# Altium schematic sheet BoardA-FPGA.SchDoc
size A; SheetNumber: 2; SheetTotal: 9
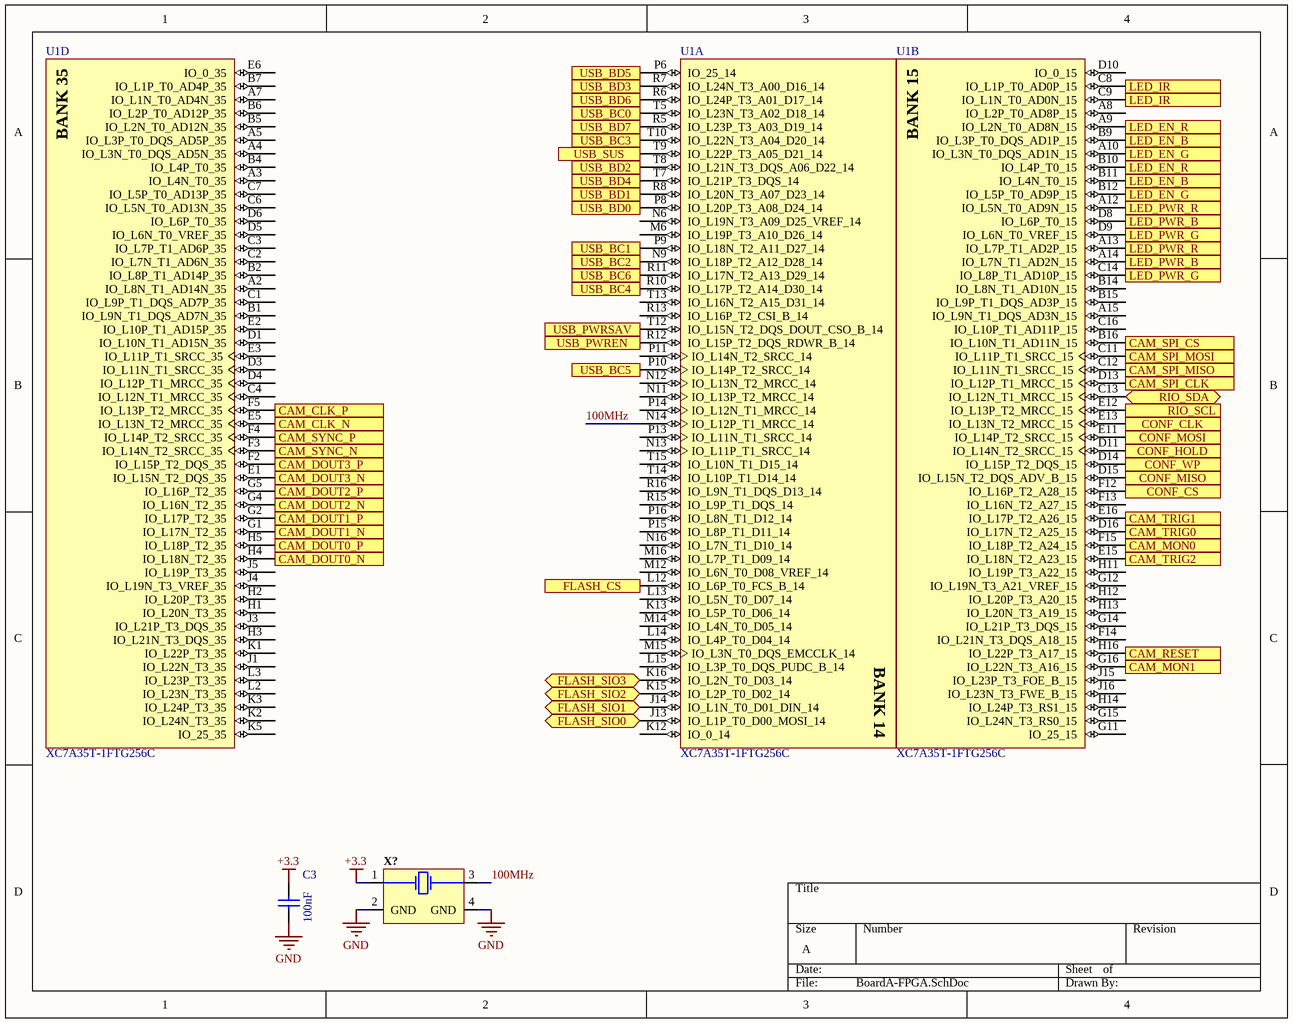
[diagram p0: BoardA-FPGA.SchDoc]

## Parts
C3  100nF  [CAPC0603X33X15ML03T05]
U1  XC7A35T-1FTG256C  [FTG256]  (parts A,B,D of 8)
X?  ASDMB-100.000MHZ-XY-T  [ASTMHTA-100.000MHZ-AJ-E-T]  (value not drawn)

## Ports
CAM_CLK_N (in), CAM_CLK_P (in), CAM_DOUT0_N (in), CAM_DOUT0_P (in), CAM_DOUT1_N (in), CAM_DOUT1_P (in), CAM_DOUT2_N (in), CAM_DOUT2_P (in), CAM_DOUT3_N (in), CAM_DOUT3_P (in), CAM_MON0 (in), CAM_MON1 (in), CAM_RESET (out), CAM_SPI_CLK (out), CAM_SPI_CS (out), CAM_SPI_MISO (in), CAM_SPI_MOSI (out), CAM_SYNC_N (in), CAM_SYNC_P (in), CAM_TRIG0 (out), CAM_TRIG1 (out), CAM_TRIG2 (out), CONF_CLK (in), CONF_CS (in), CONF_HOLD (in), CONF_MISO (out), CONF_MOSI (in), CONF_WP (in), FLASH_CS (out), FLASH_SIO0 (bidir), FLASH_SIO1 (bidir), FLASH_SIO2 (bidir), FLASH_SIO3 (bidir), LED_EN_B (out), LED_EN_G (out), LED_EN_R (out), LED_IR (out), LED_PWR_B (out), LED_PWR_G (out), LED_PWR_R (out), RIO_SCL (out), RIO_SDA (bidir), USB_BC0, USB_BC1, USB_BC2, USB_BC3, USB_BC4, USB_BC5, USB_BC6, USB_BD0, USB_BD1, USB_BD2, USB_BD3, USB_BD4, USB_BD5, USB_BD6, USB_BD7, USB_PWREN (out), USB_PWRSAV (out), USB_SUS (out)

## Nets
+3.3: C3.2 X?.1
GND: C3.1 X?.2(GND) X?.4(GND)
100MHz: U1.N14(IO_L12P_T1_MRCC_14) X?.3
CAM_CLK_N: U1.E5(IO_L13N_T2_MRCC_35) ; port CAM_CLK_N
CAM_CLK_P: U1.F5(IO_L13P_T2_MRCC_35) ; port CAM_CLK_P
CAM_DOUT0_N: U1.H4(IO_L18N_T2_35) ; port CAM_DOUT0_N
CAM_DOUT0_P: U1.H5(IO_L18P_T2_35) ; port CAM_DOUT0_P
CAM_DOUT1_N: U1.G1(IO_L17N_T2_35) ; port CAM_DOUT1_N
CAM_DOUT1_P: U1.G2(IO_L17P_T2_35) ; port CAM_DOUT1_P
CAM_DOUT2_N: U1.G4(IO_L16N_T2_35) ; port CAM_DOUT2_N
CAM_DOUT2_P: U1.G5(IO_L16P_T2_35) ; port CAM_DOUT2_P
CAM_DOUT3_N: U1.E1(IO_L15N_T2_DQS_35) ; port CAM_DOUT3_N
CAM_DOUT3_P: U1.F2(IO_L15P_T2_DQS_35) ; port CAM_DOUT3_P
CAM_MON0: U1.F15(IO_L18P_T2_A24_15) ; port CAM_MON0
CAM_MON1: U1.G16(IO_L22N_T3_A16_15) ; port CAM_MON1
CAM_RESET: U1.H16(IO_L22P_T3_A17_15) ; port CAM_RESET
CAM_SPI_CLK: U1.D13(IO_L12P_T1_MRCC_15) ; port CAM_SPI_CLK
CAM_SPI_CS: U1.B16(IO_L10N_T1_AD11N_15) ; port CAM_SPI_CS
CAM_SPI_MISO: U1.C12(IO_L11N_T1_SRCC_15) ; port CAM_SPI_MISO
CAM_SPI_MOSI: U1.C11(IO_L11P_T1_SRCC_15) ; port CAM_SPI_MOSI
CAM_SYNC_N: U1.F3(IO_L14N_T2_SRCC_35) ; port CAM_SYNC_N
CAM_SYNC_P: U1.F4(IO_L14P_T2_SRCC_35) ; port CAM_SYNC_P
CAM_TRIG0: U1.D16(IO_L17N_T2_A25_15) ; port CAM_TRIG0
CAM_TRIG1: U1.E16(IO_L17P_T2_A26_15) ; port CAM_TRIG1
CAM_TRIG2: U1.E15(IO_L18N_T2_A23_15) ; port CAM_TRIG2
CONF_CLK: U1.E13(IO_L13N_T2_MRCC_15) ; port CONF_CLK
CONF_CS: U1.F12(IO_L16P_T2_A28_15) ; port CONF_CS
CONF_HOLD: U1.D11(IO_L14N_T2_SRCC_15) ; port CONF_HOLD
CONF_MISO: U1.D15(IO_L15N_T2_DQS_ADV_B_15) ; port CONF_MISO
CONF_MOSI: U1.E11(IO_L14P_T2_SRCC_15) ; port CONF_MOSI
CONF_WP: U1.D14(IO_L15P_T2_DQS_15) ; port CONF_WP
FLASH_CS: U1.L12(IO_L6P_T0_FCS_B_14) ; port FLASH_CS
FLASH_SIO0: U1.J13(IO_L1P_T0_D00_MOSI_14) ; port FLASH_SIO0
FLASH_SIO1: U1.J14(IO_L1N_T0_D01_DIN_14) ; port FLASH_SIO1
FLASH_SIO2: U1.K15(IO_L2P_T0_D02_14) ; port FLASH_SIO2
FLASH_SIO3: U1.K16(IO_L2N_T0_D03_14) ; port FLASH_SIO3
LED_EN_B: U1.B9(IO_L3P_T0_DQS_AD1P_15) U1.B11(IO_L4N_T0_15) ; port LED_EN_B
LED_EN_G: U1.A10(IO_L3N_T0_DQS_AD1N_15) U1.B12(IO_L5P_T0_AD9P_15) ; port LED_EN_G
LED_EN_R: U1.A9(IO_L2N_T0_AD8N_15) U1.B10(IO_L4P_T0_15) ; port LED_EN_R
LED_IR: U1.C8(IO_L1P_T0_AD0P_15) U1.C9(IO_L1N_T0_AD0N_15) ; port LED_IR
LED_PWR_B: U1.A14(IO_L7N_T1_AD2N_15) U1.D8(IO_L6P_T0_15) ; port LED_PWR_B
LED_PWR_G: U1.C14(IO_L8P_T1_AD10P_15) U1.D9(IO_L6N_T0_VREF_15) ; port LED_PWR_G
LED_PWR_R: U1.A12(IO_L5N_T0_AD9N_15) U1.A13(IO_L7P_T1_AD2P_15) ; port LED_PWR_R
RIO_SCL: U1.E12(IO_L13P_T2_MRCC_15) ; port RIO_SCL
RIO_SDA: U1.C13(IO_L12N_T1_MRCC_15) ; port RIO_SDA
USB_BC0: U1.T5(IO_L23N_T3_A02_D18_14) ; port USB_BC0
USB_BC1: U1.P9(IO_L18N_T2_A11_D27_14) ; port USB_BC1
USB_BC2: U1.N9(IO_L18P_T2_A12_D28_14) ; port USB_BC2
USB_BC3: U1.T10(IO_L22N_T3_A04_D20_14) ; port USB_BC3
USB_BC4: U1.R10(IO_L17P_T2_A14_D30_14) ; port USB_BC4
USB_BC5: U1.P10(IO_L14P_T2_SRCC_14) ; port USB_BC5
USB_BC6: U1.R11(IO_L17N_T2_A13_D29_14) ; port USB_BC6
USB_BD0: U1.P8(IO_L20P_T3_A08_D24_14) ; port USB_BD0
USB_BD1: U1.R8(IO_L20N_T3_A07_D23_14) ; port USB_BD1
USB_BD2: U1.T8(IO_L21N_T3_DQS_A06_D22_14) ; port USB_BD2
USB_BD3: U1.R7(IO_L24N_T3_A00_D16_14) ; port USB_BD3
USB_BD4: U1.T7(IO_L21P_T3_DQS_14) ; port USB_BD4
USB_BD5: U1.P6(IO_25_14) ; port USB_BD5
USB_BD6: U1.R6(IO_L24P_T3_A01_D17_14) ; port USB_BD6
USB_BD7: U1.R5(IO_L23P_T3_A03_D19_14) ; port USB_BD7
USB_PWREN: U1.R12(IO_L15P_T2_DQS_RDWR_B_14) ; port USB_PWREN
USB_PWRSAV: U1.T12(IO_L15N_T2_DQS_DOUT_CSO_B_14) ; port USB_PWRSAV
USB_SUS: U1.T9(IO_L22P_T3_A05_D21_14) ; port USB_SUS

Not connected (* = marked no-connect by the designer): U1 A2(IO_L8N_T1_AD14N_35) A3(IO_L4N_T0_35) A4(IO_L3N_T0_DQS_AD5N_35) A5(IO_L3P_T0_DQS_AD5P_35) A7(IO_L1N_T0_AD4N_35) A8(IO_L2P_T0_AD8P_15) A15(IO_L9N_T1_DQS_AD3N_15) B1(IO_L9N_T1_DQS_AD7N_35) B2(IO_L8P_T1_AD14P_35) B4(IO_L4P_T0_35) B5(IO_L2N_T0_AD12N_35) B6(IO_L2P_T0_AD12P_35) B7(IO_L1P_T0_AD4P_35) B14(IO_L8N_T1_AD10N_15) B15(IO_L9P_T1_DQS_AD3P_15) C1(IO_L9P_T1_DQS_AD7P_35) C2(IO_L7N_T1_AD6N_35) C3(IO_L7P_T1_AD6P_35) C4(IO_L12N_T1_MRCC_35) C6(IO_L5N_T0_AD13N_35) C7(IO_L5P_T0_AD13P_35) C16(IO_L10P_T1_AD11P_15) D1(IO_L10N_T1_AD15N_35) D3(IO_L11N_T1_SRCC_35) D4(IO_L12P_T1_MRCC_35) D5(IO_L6N_T0_VREF_35) D6(IO_L6P_T0_35) D10(IO_0_15) E2(IO_L10P_T1_AD15P_35) E3(IO_L11P_T1_SRCC_35) E6(IO_0_35) F13(IO_L16N_T2_A27_15) F14(IO_L21N_T3_DQS_A18_15) G11(IO_25_15) G12(IO_L19N_T3_A21_VREF_15) G14(IO_L21P_T3_DQS_15) G15(IO_L24N_T3_RS0_15) H1(IO_L20N_T3_35) H2(IO_L20P_T3_35) H3(IO_L21N_T3_DQS_35) H11(IO_L19P_T3_A22_15) H12(IO_L20P_T3_A20_15) H13(IO_L20N_T3_A19_15) H14(IO_L24P_T3_RS1_15) J1(IO_L22N_T3_35) J3(IO_L21P_T3_DQS_35) J4(IO_L19N_T3_VREF_35) J5(IO_L19P_T3_35) J15(IO_L23P_T3_FOE_B_15) J16(IO_L23N_T3_FWE_B_15) K1(IO_L22P_T3_35) K2(IO_L24N_T3_35) K3(IO_L24P_T3_35) K5(IO_25_35) K12(IO_0_14) K13(IO_L5P_T0_D06_14) L2(IO_L23N_T3_35) L3(IO_L23P_T3_35) L13(IO_L5N_T0_D07_14) L14(IO_L4P_T0_D04_14) L15(IO_L3P_T0_DQS_PUDC_B_14) M6(IO_L19P_T3_A10_D26_14) M12(IO_L6N_T0_D08_VREF_14) M14(IO_L4N_T0_D05_14) M15(IO_L3N_T0_DQS_EMCCLK_14) M16(IO_L7P_T1_D09_14) N6(IO_L19N_T3_A09_D25_VREF_14) N11(IO_L13P_T2_MRCC_14) N12(IO_L13N_T2_MRCC_14) N13(IO_L11P_T1_SRCC_14) N16(IO_L7N_T1_D10_14) P11(IO_L14N_T2_SRCC_14) P13(IO_L11N_T1_SRCC_14) P14(IO_L12N_T1_MRCC_14) P15(IO_L8P_T1_D11_14) P16(IO_L8N_T1_D12_14) R13(IO_L16P_T2_CSI_B_14) R15(IO_L9P_T1_DQS_14) R16(IO_L9N_T1_DQS_D13_14) T13(IO_L16N_T2_A15_D31_14) T14(IO_L10P_T1_D14_14) T15(IO_L10N_T1_D15_14)

## Notes on the sheet
- (in symbol CMP-0383-00028-1, part A) BANK 14
- (in symbol CMP-0383-00028-1, part B) BANK 15
- (in symbol CMP-0383-00028-1, part D) BANK 35

## Library data of the parts
C3 = CMP-2010-00674-1: Manufacturer: Samsung; Part Number: CL03A104KQ3NNNC
U1 = CMP-0383-00028-1: Artix-7 FPGA, 170 User I/Os, 0 GTP, 256-Ball BGA, Speed Grade 1, Commercial Grade, Pb-Free; Manufacturer: Xilinx; Speed Grades: 1; Total Block RAM: 1800 Kb; CMTs: 5; GTP: 0; Available User I/O: 170; Logic Cells: 33280; ComponentLink2Description: Datasheet; ComponentLink2URL: http://www.xilinx.com/support/documentation/data_sheets/ds180_7Series_Overview.pdf; ComponentLink1Description: Manufacturer URL; Operating Temperature Range: Commercial; PackageVersion: Rev. 1.11; ComponentLink4URL: http://www.xilinx.com/support/documentation/user_guides/ug475_7Series_Pkg_Pinout.pdf; ComponentLink4Description: Package Specification; PackageDescription: 256-Ball Wire-Bond Fine-Pitch Thin BGA, Body 17 x 17 mm, Pitch 1 mm; Mounting Technology: Surface Mount; ComponentLink1URL: http://www.xilinx.com/; Maximum Distributed RAM: 400 Kb; PackageReference: FTG-256; DatasheetVersion: Rev. 1.15; ComponentLink3Description: Pinout; PartNumber: XC7A35T-1FTG256C; ComponentLink3URL: http://www.xilinx.com/support/documentation/user_guides/ug475_7Series_Pkg_Pinout.pdf
X? = ASTMHTA-100.000MHZ-AJ-E-T: MEMS OSC XO 100.0000MHZ LVCMOS; Manufacturer: Abracon; Frequency: 100MHz; Load Capacitance: 15pF; Operating Supply Voltage: 3.6V; Frequency Stability: 10ppm; Max Supply Current: 16mA; RoHS: Yes; Stock 1: 2824; Pricing 1: 1=3.08000, 10=2.93800, 50=2.79080, 100=2.49700, 500=2.35008 (USD); Mount: Surface Mount; Case/Package: SMD/SMT; Number of Pins: 4; Min Operating Temperature: -40°C; Max Operating Temperature: 105°C; Packaging: Tape and Reel; Termination: SMD/SMT; Series: Pure Silicon™ ASDMB; Length: 0.098inch; Width: 0.079inch; Height: 0.035inch; Radiation Hardening: No; RoHS Compliant: Yes; Lead Free: Lead Free; ComponentLink1URL: https://datasheet.ciiva.com/1389/1750124-1389392.pdf?src-supplier=Newark; ComponentLink1Description: https://datasheet.ciiva.com/1389/1750124-1389392.pdf?src-supplier=Newark; ComponentLink2URL: https://datasheet.ciiva.com/866/asdmb-866812.pdf?src-supplier=Digi-Key; ComponentLink2Description: https://datasheet.ciiva.com/866/asdmb-866812.pdf?src-supplier=Digi-Key; ComponentLink3URL: https://datasheet.ciiva.com/866/asdmb-866813.pdf?src-supplier=Digi-Key; ComponentLink3Description: https://datasheet.ciiva.com/866/asdmb-866813.pdf?src-supplier=Digi-Key; ComponentLink4URL: https://datasheet.ciiva.com/866/asdmb-866814.pdf?src-supplier=Digi-Key; ComponentLink4Description: https://datasheet.ciiva.com/866/asdmb-866814.pdf?src-supplier=Digi-Key; ComponentLink5URL: https://datasheet.ciiva.com/3177/asdmb-3177639.pdf?src-supplier=Avnet; ComponentLink5Description: https://datasheet.ciiva.com/3177/asdmb-3177639.pdf?src-supplier=Avnet; Manufacturer Part Number: ASTMHTA-100.000MHZ-AJ-E-T; Category: Oscillators; Supplier 1: Digi-Key; Supplier Part Number 1: 535-15297-1-ND